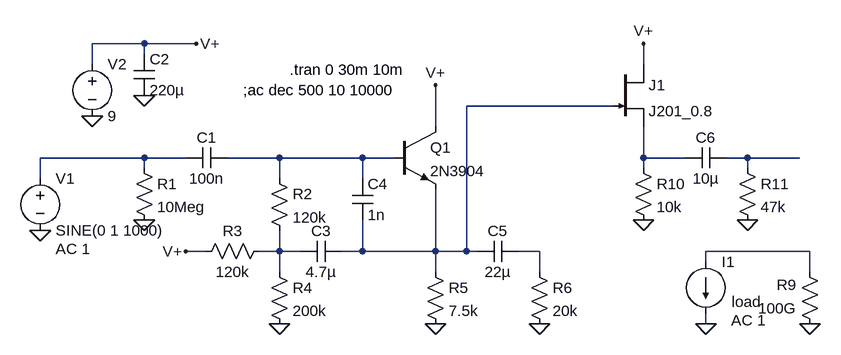
[diagram p0: schematic cornish_buffer.asc]
cornish_buffer.asc, the LTspice schematic file:
Version 4
SHEET 1 1540 680
WIRE 272 -48 192 -48
WIRE 352 -48 272 -48
WIRE 272 -32 272 -48
WIRE 192 -16 192 -48
WIRE 1040 -16 1040 -48
WIRE 992 48 768 48
WIRE 720 80 720 16
WIRE 272 128 112 128
WIRE 336 128 272 128
WIRE 480 128 400 128
WIRE 608 128 480 128
WIRE 656 128 608 128
WIRE 1040 128 1040 80
WIRE 1104 128 1040 128
WIRE 1200 128 1168 128
WIRE 1280 128 1200 128
WIRE 272 144 272 128
WIRE 1040 144 1040 128
WIRE 1200 144 1200 128
WIRE 112 160 112 128
WIRE 480 160 480 128
WIRE 608 160 608 128
WIRE 368 272 336 272
WIRE 480 272 480 240
WIRE 480 272 448 272
WIRE 512 272 480 272
WIRE 608 272 608 224
WIRE 608 272 576 272
WIRE 720 272 720 176
WIRE 720 272 608 272
WIRE 768 272 768 48
WIRE 768 272 720 272
WIRE 784 272 768 272
WIRE 880 272 848 272
WIRE 1296 272 1136 272
WIRE 1136 288 1136 272
WIRE 480 304 480 272
WIRE 720 304 720 272
WIRE 880 304 880 272
WIRE 1296 304 1296 272
WIRE 1136 384 1136 368
FLAG 112 240 0
FLAG 192 64 0
FLAG 272 224 0
FLAG 352 -48 V+
FLAG 336 272 V+
FLAG 480 384 0
FLAG 272 32 0
FLAG 720 384 0
FLAG 880 384 0
FLAG 720 16 V+
FLAG 1136 384 0
FLAG 1296 384 0
FLAG 1040 224 0
FLAG 1040 -48 V+
FLAG 1200 224 0
SYMBOL voltage 112 144 R0
WINDOW 123 24 124 Left 2
WINDOW 39 0 0 Left 2
SYMATTR Value2 AC 1
SYMATTR InstName V1
SYMATTR Value SINE(0 1 1000)
SYMBOL res 256 128 R0
SYMATTR InstName R1
SYMATTR Value 10Meg
SYMBOL cap 400 112 R90
WINDOW 0 0 32 VBottom 2
WINDOW 3 32 32 VTop 2
SYMATTR InstName C1
SYMATTR Value 100n
SYMBOL res 464 144 R0
SYMATTR InstName R2
SYMATTR Value 120k
SYMBOL voltage 192 -32 R0
WINDOW 123 0 0 Left 2
WINDOW 39 0 0 Left 2
SYMATTR InstName V2
SYMATTR Value 9
SYMBOL cap 256 -32 R0
SYMATTR InstName C2
SYMATTR Value 220µ
SYMBOL res 464 256 R90
WINDOW 0 0 56 VBottom 2
WINDOW 3 32 56 VTop 2
SYMATTR InstName R3
SYMATTR Value 120k
SYMBOL res 464 288 R0
SYMATTR InstName R4
SYMATTR Value 200k
SYMBOL cap 576 256 R90
WINDOW 0 0 32 VBottom 2
WINDOW 3 32 32 VTop 2
SYMATTR InstName C3
SYMATTR Value 4.7µ
SYMBOL cap 592 160 R0
SYMATTR InstName C4
SYMATTR Value 1n
SYMBOL npn 656 80 R0
SYMATTR InstName Q1
SYMATTR Value 2N3904
SYMBOL res 704 288 R0
SYMATTR InstName R5
SYMATTR Value 7.5k
SYMBOL cap 848 256 R90
WINDOW 0 0 32 VBottom 2
WINDOW 3 32 32 VTop 2
SYMATTR InstName C5
SYMATTR Value 22µ
SYMBOL res 864 288 R0
SYMATTR InstName R6
SYMATTR Value 20k
SYMBOL current 1136 288 R0
WINDOW 123 39 90 Left 2
WINDOW 39 40 62 Left 2
SYMATTR Value2 AC 1
SYMATTR SpiceLine load
SYMATTR InstName I1
SYMATTR Value ""
SYMBOL res 1312 400 R180
WINDOW 0 36 76 Left 2
WINDOW 3 36 40 Left 2
SYMATTR InstName R9
SYMATTR Value 100G
SYMBOL res 1024 128 R0
SYMATTR InstName R10
SYMATTR Value 10k
SYMBOL cap 1168 112 R90
WINDOW 0 0 32 VBottom 2
WINDOW 3 32 32 VTop 2
SYMATTR InstName C6
SYMATTR Value 10µ
SYMBOL res 1184 128 R0
SYMATTR InstName R11
SYMATTR Value 47k
SYMBOL njf 992 -16 R0
SYMATTR InstName J1
SYMATTR Value J201_0.8
TEXT 496 -8 Left 2 !.tran 0 30m 10m
TEXT 424 24 Left 2 !;ac dec 500 10 10000

The netlist it stands for:
* cornish_buffer.asc
V1 N002 0 SINE(0 1 1000) AC 1
R1 N002 0 10Meg
C1 N003 N002 100n
R2 N003 N006 120k
V2 V+ 0 9
C2 V+ 0 220µ
R3 N006 V+ 120k
R4 N006 0 200k
C3 N001 N006 4.7µ
C4 N003 N001 1n
Q1 V+ N003 N001 0 2N3904
R5 N001 0 7.5k
C5 N007 N001 22µ
R6 N007 0 20k
I1 N008 0 AC 1 load
R9 0 N008 100G
R10 N004 0 10k
C6 N005 N004 10µ
R11 N005 0 47k
J1 V+ N001 N004 J201_0.8
.model NPN NPN
.model PNP PNP
.lib standard.bjt
.model NJF NJF
.model PJF PJF
.lib standard.jft
.tran 0 30m 10m
;ac dec 500 10 10000
.backanno
.end